# EAGLE design US_balise_1 (EAGLE 5.11)
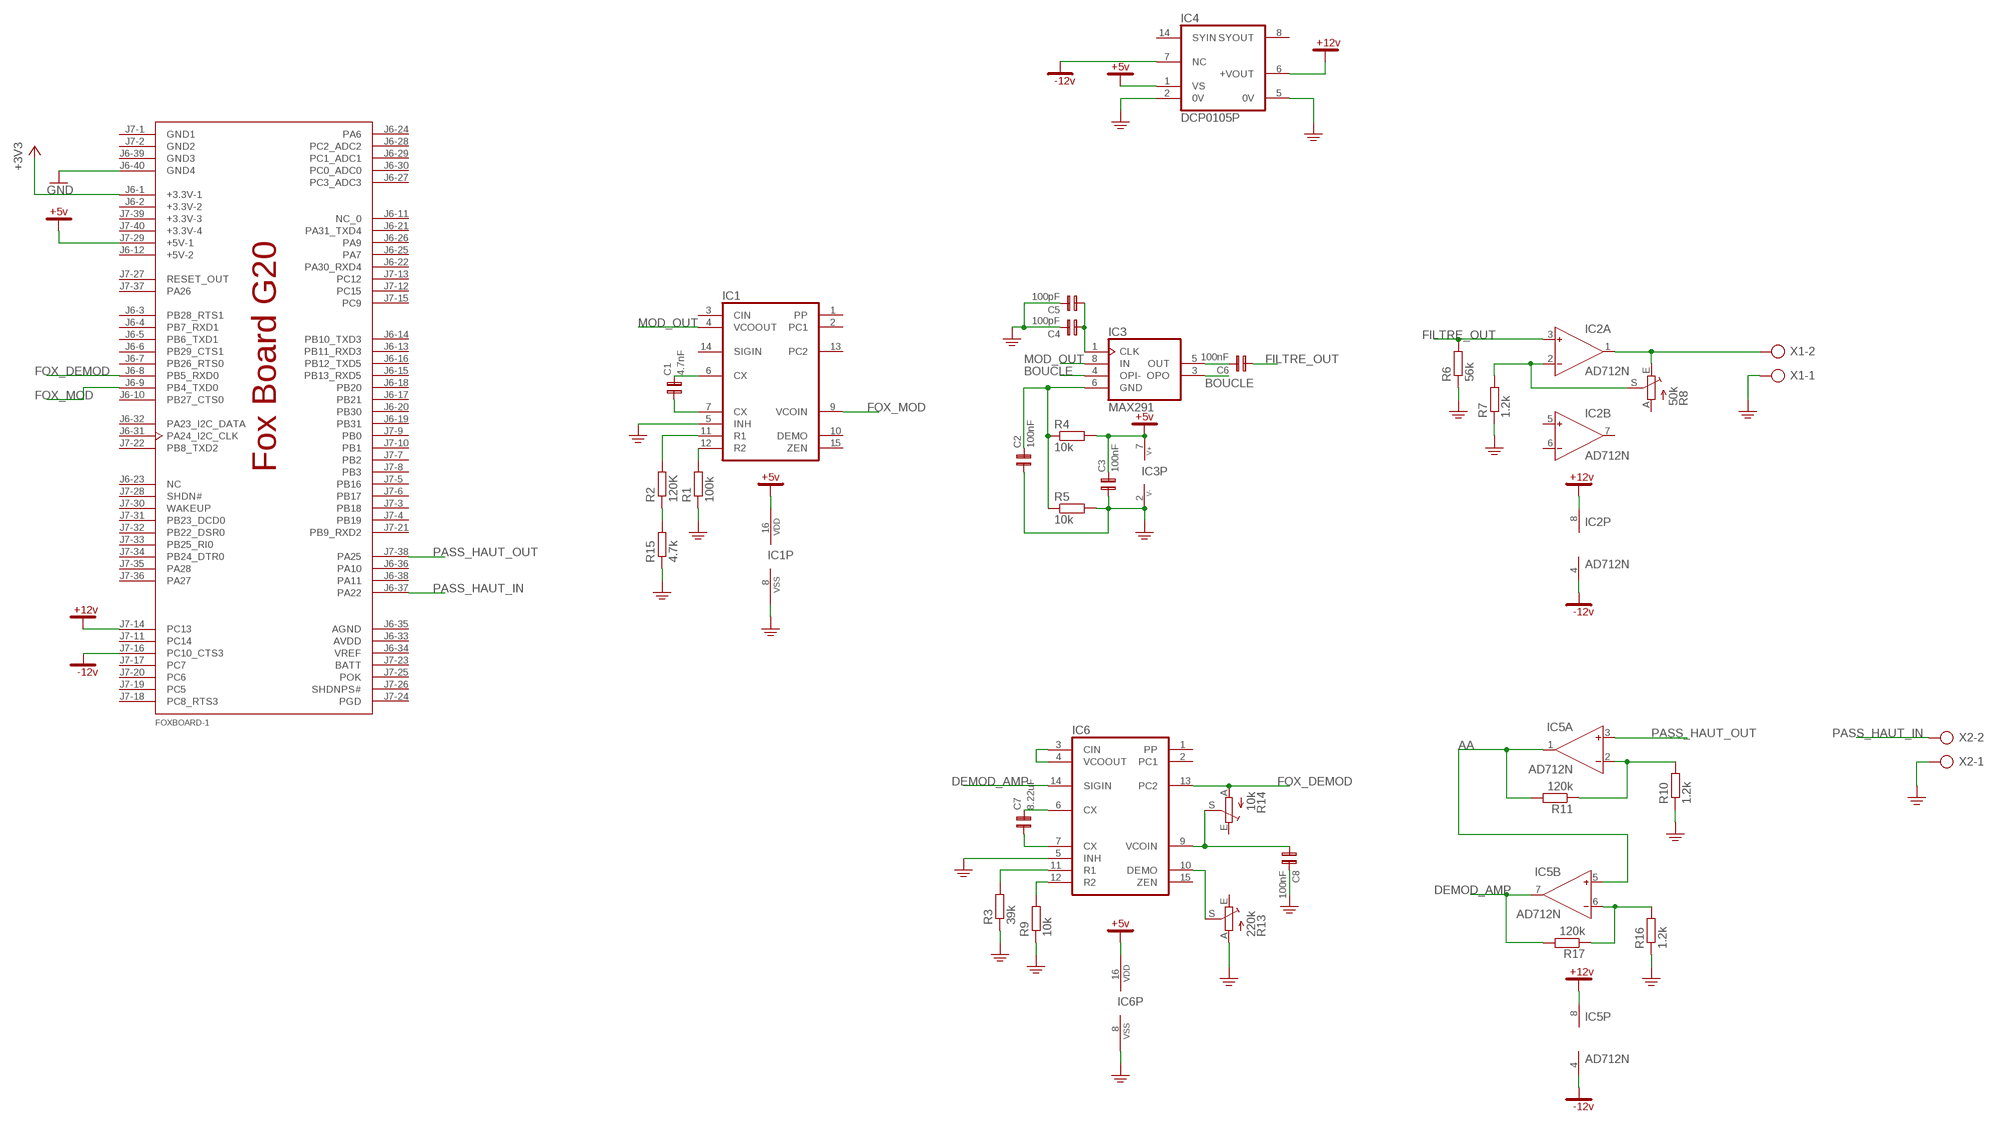
[diagram p0: schematic, sheet 1]

## Parts
C1  4.7nF  C5B2,5  [C5B2,5]
C2  100nF  C5B2,5E  [C5B2,5A]
C3  100nF  C5B2,5E  [C5B2,5A]
C4  100pF  C5B2,5  [C5B2,5]
C5  100pF  C5B2,5  [C5B2,5]
C6  100nF  C5B2,5E  [C5B2,5A]
C7  8.22uF  C5B2,5  [C5B2,5]
C8  100nF  C5B2,5E  [C5B2,5A]
FOXBOARD-1  FOX-BOARD  [FOX-BOARD]
IC1  4046  [DIL16]
IC2  AD712N  [DIL08]
IC3  MAX291  [DIL08]
IC4  DCP0105P  [DIL14/7]
IC5  AD712N  [DIL08]
IC6  4046  [DIL16]
R1  100k  R-EU_0309/12  [0309/12]
R2  120K  R-EU_0309/12  [0309/12]
R3  39k  R-EU_0309/12  [0309/12]
R4  10k  R-EU_0309/12  [0309/12]
R5  10k  R-EU_0309/12  [0309/12]
R6  56k  R-EU_0309/12  [0309/12]
R7  1.2k  R-EU_0309/12  [0309/12]
R8  50k  TRIM_EU-B90P  [SP19L]
R9  10k  R-EU_0309/12  [0309/12]
R10  1.2k  R-EU_0309/12  [0309/12]
R11  120k  R-EU_0309/12  [0309/12]
R13  220k  TRIM_EU-B90P  [SP19L]
R14  10k  TRIM_EU-S63P  [S63P]
R15  4.7k  R-EU_0309/12  [0309/12]
R16  1.2k  R-EU_0309/12  [0309/12]
R17  120k  R-EU_0309/12  [0309/12]
X1  AK300/2  [AK300/2]
X2  AK300/2  [AK300/2]

## Nets
+3V3: FOXBOARD-1.J6-1(+3.3V-1)
+5V: C3.2 FOXBOARD-1.J7-29(+5V-1) IC1.16(VDD) IC3.7(V+) IC4.1(VS) IC6.16(VDD) R4.2
+12V: FOXBOARD-1.J7-14(PC13) IC2.8(P:V+) IC4.6(+VOUT) IC5.8(P:V+)
-12V: FOXBOARD-1.J7-16(PC10_CTS3) IC2.4(P:V-) IC4.7(NC) IC5.4(P:V-)
AA: IC5.1(A:OUT) IC5.5(B:IN+) R11.2
BOUCLE: IC3.3(OPO) IC3.4(OPI-)
DEMOD_AMP: IC5.7(B:OUT) IC6.14(SIGIN) R17.2
FILTRE_OUT: C6.1 IC2.3(A:IN+) R6.2
FOX_DEMOD: FOXBOARD-1.J6-8(PB5_RXD0) IC6.13(PC2) R14.A
FOX_MOD: FOXBOARD-1.J6-9(PB4_TXD0) IC1.9(VCOIN)
GND: C2.1 C3.1 C4.2 C5.2 C8.2 FOXBOARD-1.J6-40(GND4) IC1.5(INH) IC1.8(VSS) IC3.2(V-) IC4.2(0V) IC4.5(0V) IC6.5(INH) IC6.8(VSS) R1.1 R3.1 R5.2 R6.1 R7.1 R9.1 R10.1 R13.A R15.1 R16.1 X1.1 X2.1
MOD_OUT: IC1.4(VCOOUT) IC3.8(IN)
N$1: C1.2 IC1.6(CX)
N$2: C1.1 IC1.7(CX)
N$3: IC1.12(R2) R1.2
N$4: IC1.11(R1) R2.2
N$5: IC6.12(R2) R9.2
N$6: C6.2 IC3.5(OUT)
N$7: C2.2 IC3.6(GND) R4.1 R5.1
N$8: R2.1 R15.2
N$9: C4.1 C5.1 IC3.1(CLK)
N$10: IC2.2(A:IN-) R7.2 R8.S
N$11: IC2.1(A:OUT) R8.E X1.2
N$12: IC5.6(B:IN-) R16.2 R17.1
N$13: IC6.3(CIN) IC6.4(VCOOUT)
N$14: IC5.2(A:IN-) R10.2 R11.1
N$15: C7.2 IC6.6(CX)
N$16: C7.1 IC6.7(CX)
N$17: IC6.11(R1) R3.2
N$21: C8.1 IC6.9(VCOIN) R14.S
N$49: IC6.10(DEMO) R13.S
PASS_HAUT_IN: FOXBOARD-1.J6-37(PA22) X2.2
PASS_HAUT_OUT: FOXBOARD-1.J7-38(PA25) IC5.3(A:IN+)
Unconnected: FOXBOARD-1.J6-3(PB28_RTS1) FOXBOARD-1.J6-4(PB7_RXD1) FOXBOARD-1.J6-5(PB6_TXD1) FOXBOARD-1.J6-6(PB29_CTS1) FOXBOARD-1.J6-7(PB26_RTS0) FOXBOARD-1.J6-10(PB27_CTS0) FOXBOARD-1.J6-11(NC_0) FOXBOARD-1.J6-13(PB11_RXD3) FOXBOARD-1.J6-14(PB10_TXD3) FOXBOARD-1.J6-15(PB13_RXD5) FOXBOARD-1.J6-16(PB12_TXD5) FOXBOARD-1.J6-17(PB21) FOXBOARD-1.J6-18(PB20) FOXBOARD-1.J6-19(PB31) FOXBOARD-1.J6-20(PB30) FOXBOARD-1.J6-21(PA31_TXD4) FOXBOARD-1.J6-22(PA30_RXD4) FOXBOARD-1.J6-23(NC) FOXBOARD-1.J6-24(PA6) FOXBOARD-1.J6-25(PA7) FOXBOARD-1.J6-26(PA9) FOXBOARD-1.J6-27(PC3_ADC3) FOXBOARD-1.J6-28(PC2_ADC2) FOXBOARD-1.J6-29(PC1_ADC1) FOXBOARD-1.J6-30(PC0_ADC0) FOXBOARD-1.J6-31(PA24_I2C_CLK) FOXBOARD-1.J6-32(PA23_I2C_DATA) FOXBOARD-1.J6-33(AVDD) FOXBOARD-1.J6-34(VREF) FOXBOARD-1.J6-35(AGND) FOXBOARD-1.J6-36(PA10) FOXBOARD-1.J6-38(PA11) FOXBOARD-1.J7-3(PB18) FOXBOARD-1.J7-4(PB19) FOXBOARD-1.J7-5(PB16) FOXBOARD-1.J7-6(PB17) FOXBOARD-1.J7-7(PB2) FOXBOARD-1.J7-8(PB3) FOXBOARD-1.J7-9(PB0) FOXBOARD-1.J7-10(PB1) FOXBOARD-1.J7-11(PC14) FOXBOARD-1.J7-12(PC15) FOXBOARD-1.J7-13(PC12) FOXBOARD-1.J7-15(PC9) FOXBOARD-1.J7-17(PC7) FOXBOARD-1.J7-18(PC8_RTS3) FOXBOARD-1.J7-19(PC5) FOXBOARD-1.J7-20(PC6) FOXBOARD-1.J7-21(PB9_RXD2) FOXBOARD-1.J7-22(PB8_TXD2) FOXBOARD-1.J7-23(BATT) FOXBOARD-1.J7-24(PGD) FOXBOARD-1.J7-25(POK) FOXBOARD-1.J7-26(SHDNPS#) FOXBOARD-1.J7-27(RESET_OUT) FOXBOARD-1.J7-28(SHDN#) FOXBOARD-1.J7-30(WAKEUP) FOXBOARD-1.J7-31(PB23_DCD0) FOXBOARD-1.J7-32(PB22_DSR0) FOXBOARD-1.J7-33(PB25_RI0) FOXBOARD-1.J7-34(PB24_DTR0) FOXBOARD-1.J7-35(PA28) FOXBOARD-1.J7-36(PA27) FOXBOARD-1.J7-37(PA26) IC1.1(PP) IC1.2(PC1) IC1.3(CIN) IC1.10(DEMO) IC1.13(PC2) IC1.14(SIGIN) IC1.15(ZEN) IC2.5(B:IN+) IC2.6(B:IN-) IC2.7(B:OUT) IC4.8(SYOUT) IC4.14(SYIN) IC6.1(PP) IC6.2(PC1) IC6.15(ZEN) R8.A R13.E R14.E

## Power pins joined to a net without a drawn wire
+3.3V-2: FOXBOARD-1.J6-2(+3.3V-2)
+3.3V-3: FOXBOARD-1.J7-39(+3.3V-3)
+3.3V-4: FOXBOARD-1.J7-40(+3.3V-4)
+5V-2: FOXBOARD-1.J6-12(+5V-2)
GND1: FOXBOARD-1.J7-1(GND1)
GND2: FOXBOARD-1.J7-2(GND2)
GND3: FOXBOARD-1.J6-39(GND3)

## Library data of the parts
C1 C4 C5 C7 = CAP:C5B2,5
C2 C3 C6 C8 = CAP:C5B2,5E
FOXBOARD-1 = Julien:FOX-BOARD
IC1 IC6 = 40XX:4046
IC2 IC5 = analog-devices:AD712: Dual Precision, Low Cost, High Speed BiFET Op Amp Source: http://www.analog.com/static/imported-files/data_sheets/AD712.pdf; MF: ALTERA CORPORATION; MPN: AD712JNZ; OC_FARNELL: 9604898; OC_NEWARK: 59K4554
IC3 = maxim:MAX291: DIGITAL FILTER; MPN: MAX291CPA+; OC_FARNELL: unknown; OC_NEWARK: 67K4526
IC4 = burr-brown:DCP0105: DC/DC Converters Miniature 5V Input, 1W Isolated Unregulated; MPN: DCP010512BP-U; OC_FARNELL: 1461015; OC_NEWARK: 61M5777
R1-R7 R9-R11 R15-R17 = rcl:R-EU_: RESISTOR, European symbol
R8 R13 R14 = pot:TRIM_EU-: POTENTIOMETER
X1 X2 = con-ptr500:AK300/2: CONNECTOR; OC_FARNELL: unknown; OC_NEWARK: unknown

## Board
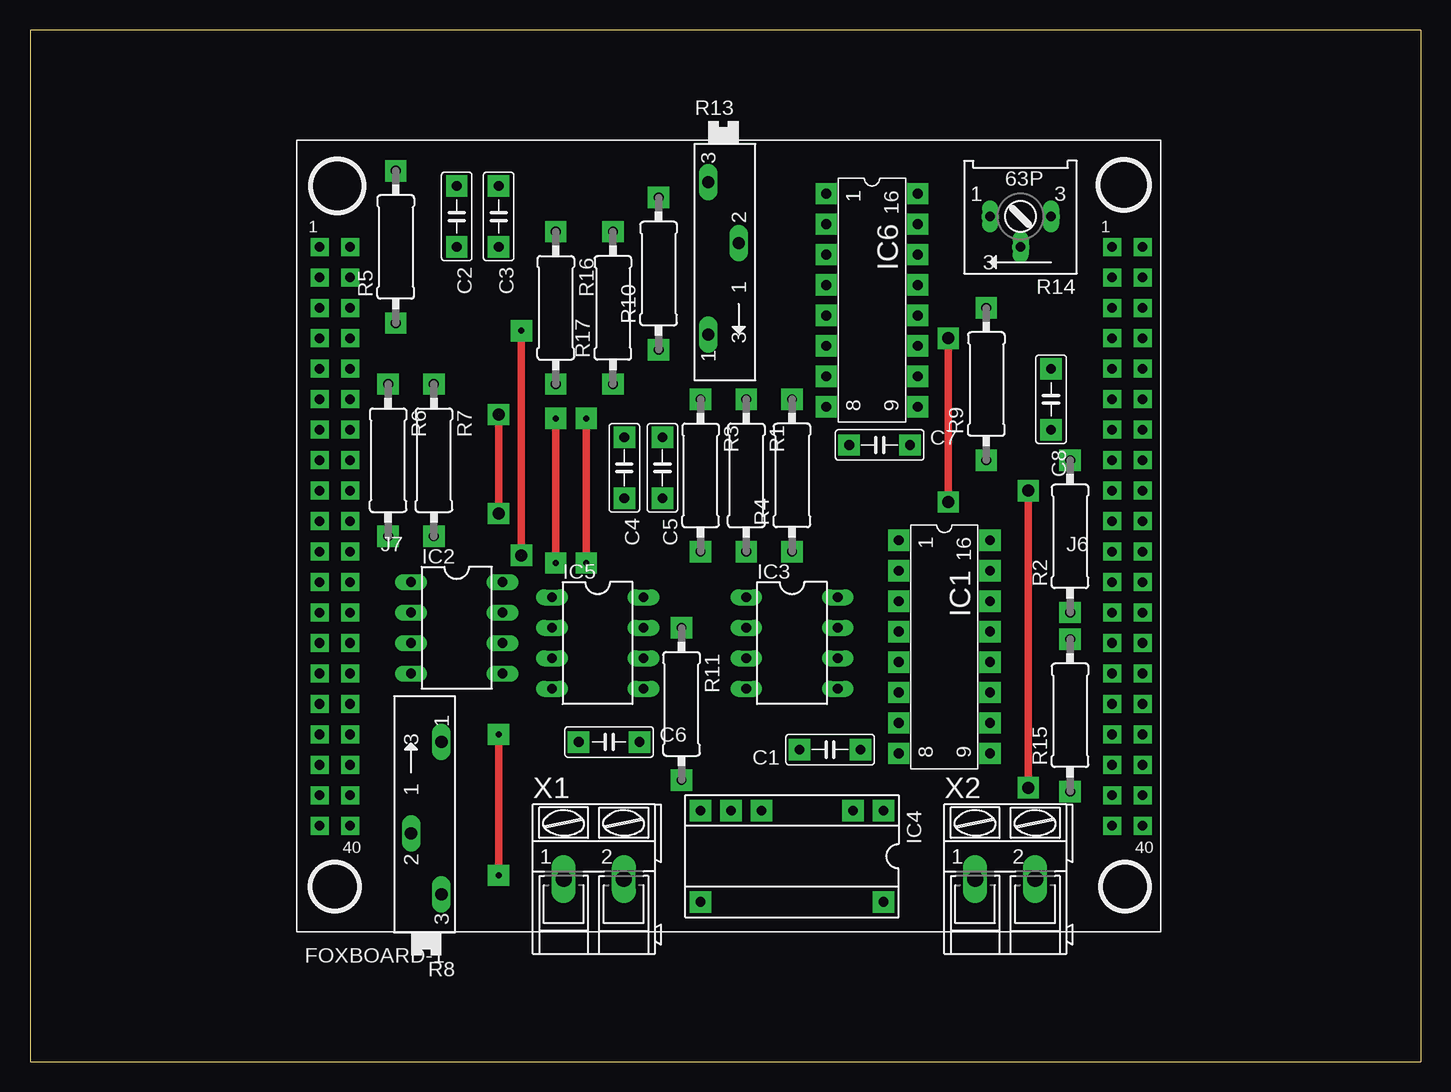
[diagram p1: board, top side]
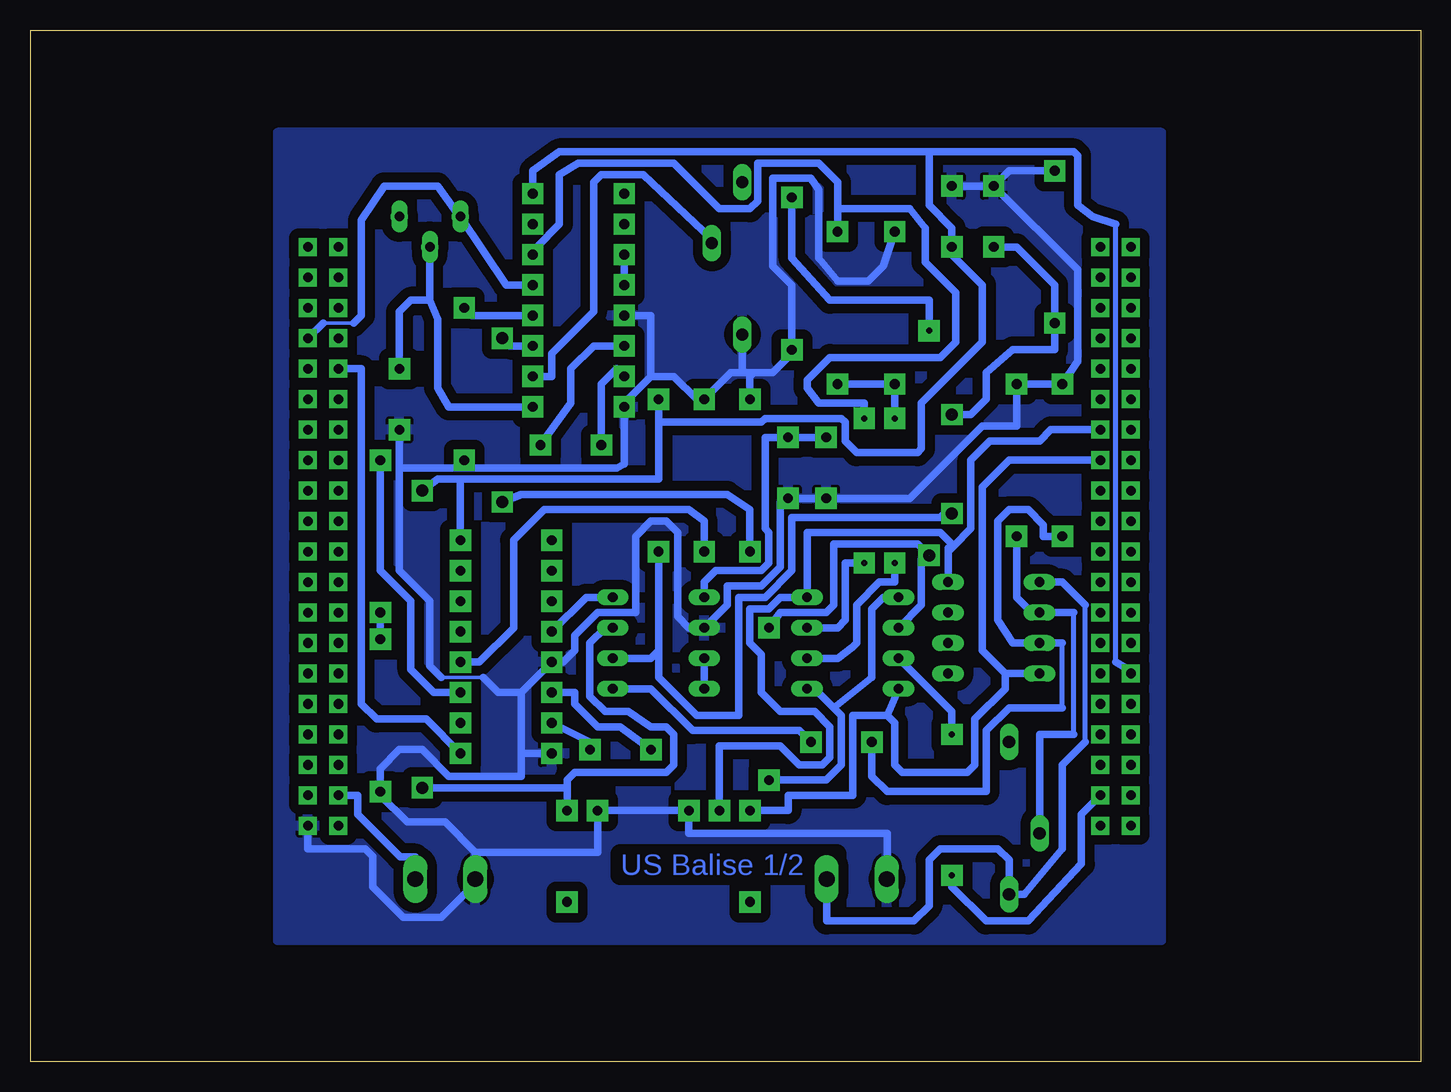
[diagram p2: board, bottom side, seen from below]

Size 115.88 x 86.03 mm. Coordinates in mm from the lower left corner, seen from the top.
Outline: 0,0 115.88,0 115.88,86.03 0,86.03 0,0
Copper layers (1*16): Top 0.035mm / dielectric 1.5mm / Bottom 0.035mm
Design rules "default": minimum track width 10mil, minimum drill 24mil, track to track 8mil, track to pad 8mil, pad to pad 8mil, via to via 8mil, smd to smd 8mil, copper to edge 40mil, drill to drill 8mil, minimum pad ring 10mil, minimum via ring 8mil, stop-mask expansion 4mil, vias tented up to drill 0mil, thermal gap 10mil

### Footprints (pad centres in the part's own frame; a part is rotated, then mirrored left to right if it is on the bottom)
C5B2,5 = drill 0.813 pad 1.778 square: 1 -2.54,0; 2 2.54,0
C5B2,5A = drill 0.813 pad 1.778 square: 1 -2.54,0; 2 2.54,0
FOX-BOARD = drill 0.8 pad 1.5 square: J6-1 31.75,22.86; J6-2 34.29,22.86; J6-3 31.75,20.32; J6-4 34.29,20.32; J6-5 31.75,17.78; J6-6 34.29,17.78; J6-7 31.75,15.24; J6-8 34.29,15.24; J6-9 31.75,12.7; J6-10 34.29,12.7; J6-11 31.75,10.16; J6-12 34.29,10.16; J6-13 31.75,7.62; J6-14 34.29,7.62; J6-15 31.75,5.08; J6-16 34.29,5.08; J6-17 31.75,2.54; J6-18 34.29,2.54; J6-19 31.75,0; J6-20 34.29,0; J6-21 31.75,-2.54; J6-22 34.29,-2.54; J6-23 31.75,-5.08; J6-24 34.29,-5.08; J6-25 31.75,-7.62; J6-26 34.29,-7.62; J6-27 31.75,-10.16; J6-28 34.29,-10.16; J6-29 31.75,-12.7; J6-30 34.29,-12.7; J6-31 31.75,-15.24; J6-32 34.29,-15.24; J6-33 31.75,-17.78; J6-34 34.29,-17.78; J6-35 31.75,-20.32; J6-36 34.29,-20.32; J6-37 31.75,-22.86; J6-38 34.29,-22.86; J6-39 31.75,-25.4; J6-40 34.29,-25.4; J7-1 -34.29,22.86; J7-2 -31.75,22.86; J7-3 -34.29,20.32; J7-4 -31.75,20.32; J7-5 -34.29,17.78; J7-6 -31.75,17.78; J7-7 -34.29,15.24; J7-8 -31.75,15.24; J7-9 -34.29,12.7; J7-10 -31.75,12.7; J7-11 -34.29,10.16; J7-12 -31.75,10.16; J7-13 -34.29,7.62; J7-14 -31.75,7.62; J7-15 -34.29,5.08; J7-16 -31.75,5.08; J7-17 -34.29,2.54; J7-18 -31.75,2.54; J7-19 -34.29,0; J7-20 -31.75,0; J7-21 -34.29,-2.54; J7-22 -31.75,-2.54; J7-23 -34.29,-5.08; J7-24 -31.75,-5.08; J7-25 -34.29,-7.62; J7-26 -31.75,-7.62; J7-27 -34.29,-10.16; J7-28 -31.75,-10.16; J7-29 -34.29,-12.7; J7-30 -31.75,-12.7; J7-31 -34.29,-15.24; J7-32 -31.75,-15.24; J7-33 -34.29,-17.78; J7-34 -31.75,-17.78; J7-35 -34.29,-20.32; J7-36 -31.75,-20.32; J7-37 -34.29,-22.86; J7-38 -31.75,-22.86; J7-39 -34.29,-25.4; J7-40 -31.75,-25.4
DIL16 = drill 0.813 pad 1.778 square: 1 -8.89,-3.81; 2 -6.35,-3.81; 3 -3.81,-3.81; 4 -1.27,-3.81; 5 1.27,-3.81; 6 3.81,-3.81; 7 6.35,-3.81; 8 8.89,-3.81; 9 8.89,3.81; 10 6.35,3.81; 11 3.81,3.81; 12 1.27,3.81; 13 -1.27,3.81; 14 -3.81,3.81; 15 -6.35,3.81; 16 -8.89,3.81
DIL08 = drill 0.813 long: 1 -3.81,-3.81; 2 -1.27,-3.81; 3 1.27,-3.81; 4 3.81,-3.81; 5 3.81,3.81; 6 1.27,3.81; 7 -1.27,3.81; 8 -3.81,3.81
DIL14/7 = drill 0.813 pad 1.6 octagon: 1 -7.62,-3.81; 2 -5.08,-3.81; 5 2.54,-3.81; 6 5.08,-3.81; 7 7.62,-3.81; 8 7.62,3.81; 14 -7.62,3.81
0309/12 = drill 0.813 octagon: 1 -6.35,0; 2 6.35,0
SP19L = drill 1.016 long: A 5.715,-1.27; E -6.985,-1.27; S -1.905,1.27
S63P = drill 0.813 long: A 2.54,0; E -2.54,0; S 0,2.54
AK300/2 = drill 1.321 long: 1 -2.515,0; 2 2.489,0

### Placement (x,y rotation side)
C1  66.67,26.04 180 top
C2  35.56,70.48 270 top
C3  39.05,70.48 270 top
C4  49.53,49.53 270 top
C5  52.7,49.53 270 top
C6  48.26,26.67 0 top
C7  70.8,51.44 0 top
C8  85.09,55.24 270 top
FOXBOARD-1  58.42,45.09 0 top
IC1  76.2,34.61 270 top
IC2  35.56,36.2 270 top
IC3  63.5,34.92 270 top
IC4  63.5,17.14 180 top
IC5  47.31,34.92 270 top
IC6  70.17,63.5 270 top
R1  59.69,48.9 270 top
R2  86.68,43.81 90 top
R3  55.88,48.9 270 top
R4  63.5,48.9 90 top
R5  30.48,67.94 90 top
R6  29.84,50.16 270 top
R7  33.66,50.16 270 top
R8  33.02,20.95 90 top
R9  79.69,56.52 90 top
R10  52.39,65.72 90 top
R11  54.29,29.84 270 top
R13  57.78,66.36 270 top
R14  82.55,70.48 180 top
R15  86.68,28.89 90 top
R16  43.81,62.87 270 top
R17  48.58,62.87 90 top
X1  46.99,15.24 0 top
X2  81.28,15.24 0 top

### Tracks (layer width: path | path; a pad name or v marks a point on that pad's centre or on a via)
+5V  (via drill 1 pad 0.13)
  Top 0.61: v83.19,47.62 v83.19,22.86
  Bottom 0.406: 25.4,33.34 25.4,69.85
  Bottom 0.61: 71.12,22.86 71.12,23.5 70.48,24.13 62.87,24.13 62.23,24.77 62.23,27.3 62.87,27.94 64.14,27.94 66.04,29.21 67.94,29.21 69.22,30.48 69.22,34.92 67.94,36.2 IC3.7 | 71.12,22.86 IC4.1 | 80.01,48.58 IC1.16 | 80.01,48.58 63.5,48.58 R4.2 63.5,53.34 54.93,53.34 54.61,53.66 48.26,53.66 47.94,53.34 47.94,51.75 46.99,50.8 41.91,50.8 41.59,51.12 41.59,54.93 36.51,60.01 36.51,64.77 39.05,67.31 C3.2 39.05,69.53 40.96,71.44 40.96,75.88 | FOXBOARD-1.J7-29 23.81,32.38 25.4,33.34 | 25.4,69.85 27.3,70.48 28.57,71.44 28.57,75.56 28.89,75.88 40.96,75.88 | 80.01,48.58 81.92,48.58 v83.19,47.62 | v83.19,22.86 71.12,22.86 | IC6.16 73.98,74.3 71.75,75.88 40.96,75.88
+12V
  Bottom 0.61: IC4.6 58.42,26.35 53.34,26.35 51.75,24.77 49.85,24.77 49.21,25.4 49.21,27.94 50.48,29.21 53.34,29.21 54.93,30.8 54.93,33.97 55.88,34.92 55.88,37.78 54.29,37.78 53.34,38.73 IC5.8 51.12,44.13 40.01,44.13 38.89,43.02 | 38.89,43.02 37.47,44.45 37.47,50.16 35.88,51.75 31.75,51.75 30.8,52.7 FOXBOARD-1.J7-14 | 38.89,43.02 39.37,42.55 IC2.8 39.37,42.86
-12V
  Bottom 0.61: 34.61,32.38 IC2.4 | 44.45,28.89 IC5.4 | IC4.7 52.7,20.95 52.7,22.23 47.31,22.23 47.31,28.89 44.45,28.89 | 34.61,32.38 34.61,31.11 37.15,28.57 37.15,24.77 37.78,24.13 43.18,24.13 43.81,24.77 43.81,28.26 44.45,28.89 | FOXBOARD-1.J7-16 34.29,50.16 36.51,47.94 36.51,34.29 34.61,32.38
AA
  Bottom 0.61: IC5.5 50.48,31.11 48.9,29.53 | R11.2 49.53,23.5 48.26,24.77 48.26,28.89 48.9,29.53 | IC5.1 44.77,38.73 45.72,37.78 45.72,32.07 48.9,29.53
BOUCLE
  Bottom 0.61: IC3.4 IC3.3
DEMOD_AMP  (via drill 0.5 pad 1.78)  (1 unrouted)
  Top 0.61: 46.35,41.59 v46.35,53.66
  Bottom 0.61: IC6.14 73.66,67.94 71.75,69.85 71.75,73.98 70.17,74.93 62.23,74.93 58.42,71.12 55.88,71.12 55.24,71.75 55.24,74.93 50.16,74.93 48.58,73.34 48.58,71.12 | 48.58,71.12 R17.2 | 48.58,71.12 42.55,71.12 41.27,69.53 41.27,66.67 38.73,64.14 38.73,60.01 40.01,58.74 49.21,58.74 51.12,56.83 51.12,56.2 50.16,54.93 46.35,54.93 v46.35,53.66 | IC5.7 48.58,36.2 47.94,36.83 47.94,41.59 46.35,41.59
FILTRE_OUT
  Bottom 0.406: 29.84,29.53 29.84,34.92
  Bottom 0.61: 29.84,29.53 34.29,29.53 36.2,27.62 36.2,22.54 44.45,22.54 45.72,23.81 C6.1 | 29.84,34.92 IC2.3 33.97,34.92 35.24,36.83 35.24,45.09 34.29,46.04 32.7,46.04 31.43,44.77 31.43,43.81 R6.2
FOX_DEMOD
  Bottom 0.305: 88.9,61.59 91.44,61.59
  Bottom 0.61: 88.9,61.59 88.27,62.23 88.27,70.17 86.36,73.03 81.92,73.03 80.33,70.8 R14.A 76.2,64.77 IC6.13 | 91.44,61.59 FOXBOARD-1.J6-8
FOX_MOD
  Bottom 0.61: FOXBOARD-1.J6-9 88.27,57.78 88.27,29.84 87,28.57 82.87,28.57 IC1.9
GND
  Bottom 0.305: 78.11,32.07 81.6,32.07
  Bottom 0.61: FOXBOARD-1.J6-40 92.71,17.78 87.95,17.78 87.31,17.14 87.31,14.61 84.77,12.06 81.6,12.06 78.77,14.9 X2.1 78.77,17.46 | X1.1 44.45,15.24 44.45,19.05 60.96,19.05 IC4.5 IC4.2 68.58,17.46 78.77,17.46 | 74.93,25.72 IC1.8 | 74.93,25.72 74.93,23.81 80.96,23.81 83.19,26.04 85.09,26.04 86.68,24.45 R15.1 86.68,22.23 84.45,20 81.28,20 78.77,17.49 78.77,17.46 | C2.1 C3.1 | C2.1 28.57,66.04 28.57,58.42 R6.1 R7.1 33.66,53.02 36.51,53.02 42.55,46.99 C4.2 C5.2 53.34,46.67 53.34,41.27 54.93,39.69 57.78,39.69 57.78,38.1 IC3.2 60.96,36.2 61.91,37.15 61.91,44.13 62.87,45.09 64.14,45.09 65.41,43.81 65.41,37.47 68.58,37.47 70.48,35.56 70.48,34.29 71.44,33.34 IC1.5 74.93,30.8 | 85.09,49.53 79.69,49.53 | 79.69,49.53 66.99,49.53 66.36,49.85 IC6.8 66.04,55.24 64.14,57.15 | 85.09,49.53 C8.2 | 79.69,49.53 R9.1 | R5.2 34.29,74.3 C2.1 | 64.14,57.15 64.14,62.23 IC6.5 | 64.14,57.15 62.23,57.15 60.33,55.24 R1.1 57.47,57.47 56.52,57.47 | 56.52,57.47 55.56,57.47 | 55.56,57.47 53.98,57.47 52.39,59.05 R10.1 52.39,64.77 53.98,66.36 53.98,73.66 50.8,73.66 50.16,72.71 50.16,66.99 48.58,65.09 46.04,65.09 44.77,66.36 R16.1 | 74.93,25.72 74.93,30.8 | 74.93,30.8 76.83,30.8 78.11,32.07 | 81.6,32.07 82.55,33.02 82.55,38.42 85.09,40.96 85.09,49.53 | R3.1 55.88,57.15 55.56,57.47 | 56.52,57.47 R13.A
  pour Bottom (isolate 0.813): 21.91,77.47 95.25,77.47 95.25,10.16 21.59,10.16 21.59,77.47
MOD_OUT
  Bottom 0.61: IC3.8 69.53,38.73 IC1.4
N$1
  Bottom 0.61: IC1.6 70.48,30.8 70.48,29.84 68.58,27.94 66.67,27.94 C1.2
N$2
  Bottom 0.61: C1.1 69.22,26.67 IC1.7
N$3
  Bottom 0.61: R1.2 59.69,45.09 60.96,46.04 73.03,46.04 75.56,43.5 75.56,36.2 78.42,33.34 IC1.12
N$4
  Bottom 0.61: IC1.11 82.23,30.8 84.14,32.7 84.14,38.42 86.68,40.96 R2.2
N$5
  Bottom 0.61: IC6.12 79.06,62.23 R9.2
N$6
  Bottom 0.61: IC3.5 64.14,31.11 60.64,27.62 51.75,27.62 C6.2
N$7  (via drill 1 pad 0.13)  (1 unrouted)
  Top 0.61: v39.05,45.72 39.05,53.98
  Bottom 0.61: IC3.6 64.14,33.66 63.5,34.29 R4.1 63.5,32.07 60.33,28.89 56.83,28.89 56.83,38.73 54.61,38.73 52.39,40.96 52.39,45.4 40.01,45.4 39.69,45.72 v39.05,45.72 | C2.2 33.66,67.94 30.48,64.77 R5.1 30.48,59.37 33.97,59.37 36.2,57.47 36.2,55.24 37.47,53.98 39.05,53.98 39.05,53.66
N$8
  Bottom 0.61: R15.2 R2.1
N$9
  Bottom 0.61: C4.1 C5.1 54.61,52.07 54.61,44.45 54.29,44.13 54.29,41.59 54.93,40.96 58.74,40.96 59.69,40.01 IC3.1
N$10
  Bottom 0.406: 28.89,27.3 28.89,37.47
  Bottom 0.61: R8.S 31.75,27.3 28.89,27.3 | 28.89,37.47 IC2.2 32.38,37.47 33.66,38.73 R7.2
N$11
  Bottom 0.406: 27.94,26.67 27.94,38.1
  Bottom 0.61: X1.2 49.48,11.75 42.23,11.75 40.96,13.02 40.96,16.83 40.01,17.78 35.24,17.78 34.29,16.83 R8.E 33.02,13.97 29.84,17.78 29.84,24.77 27.94,26.67 | 27.94,38.1 29.84,40.01 IC2.1
N$12  (via drill 0.5 pad 1.78)  (1 unrouted)
  Top 0.61: 43.81,41.59 v43.81,53.66
  Bottom 0.61: R17.1 R16.2 v43.81,53.66 | IC5.6 48.58,33.66 47.31,34.61 46.99,34.92 46.99,38.1 45.09,40.01 43.81,40.01 43.81,41.59
N$13
  Bottom 0.61: IC6.4 IC6.3
N$14  (via drill 0.5 pad 1.78)  (1 unrouted)
  Top 0.61: 40.96,42.23 v40.96,60.96
  Bottom 0.61: v40.96,60.96 40.96,63.5 49.21,63.5 52.39,66.99 R10.2 | R11.1 53.34,37.47 49.53,37.47 48.9,38.1 48.9,43.18 41.91,43.18 41.12,42.39 | 41.12,42.39 40.96,42.23 | IC5.2 41.59,38.1 41.59,41.91 41.12,42.39
N$15
  Bottom 0.61: IC6.6 68.9,59.69 70.8,57.78 70.8,54.93 C7.2 73.66,51.75
N$16
  Bottom 0.61: IC6.7 66.99,57.78 68.26,56.52 C7.1
N$17  (via drill 1 pad 0.13)
  Top 0.61: v76.52,46.67 v76.52,60.33
  Bottom 0.61: R3.2 55.88,46.04 57.78,47.31 74.93,47.31 v76.52,46.67 | IC6.11 75.88,59.69 v76.52,60.33
N$18  (via drill 0.5 pad 1.78)
  other vias: 54.29,36.2
N$20  (via drill 0.5 pad 1.78)
  other vias: 43.81,41.59
N$21
  Bottom 0.61: IC6.9 80.96,54.61 81.92,56.2 81.92,61.91 82.55,63.5 | 82.55,63.5 R14.S | 82.55,63.5 84.14,63.5 85.09,62.55 C8.1
N$22  (via drill 1 pad 0.13)
  other vias: 83.19,47.62
N$23  (via drill 0.5 pad 1.78)
  other vias: 54.29,23.5
N$24  (via drill 1 pad 0.13)
  other vias: 39.05,53.98
N$25  (via drill 0.5 pad 1.02)
  other vias: 31.75,19.05
N$26  (via drill 1 pad 0.13)
  other vias: 40.96,42.23
N$27  (via drill 0.5 pad 1.42)
  other vias: 83.82,15.24
N$28  (via drill 0.5 pad 1.02)
  other vias: 34.29,26.67
N$29  (via drill 0.5 pad 1.02)
  other vias: 34.29,13.97
N$30  (via drill 0.5 pad 1.42)
  other vias: 82.55,67.94
N$31  (via drill 0.5 pad 1.42)
  other vias: 49.53,15.24
N$32  (via drill 1 pad 0.13)
  other vias: 83.19,22.86
N$33  (via drill 0.5 pad 1.42)
  other vias: 44.45,15.24
N$34  (via drill 0.5 pad 1.42)
  other vias: 78.74,15.24
N$36  (via drill 0.5 pad 1.42)
  other vias: 56.52,73.34
N$38  (via drill 0.5 pad 1.42)
  other vias: 56.52,60.64
N$39  (via drill 0.5 pad 1.42)
  other vias: 59.05,68.26
N$40  (via drill 0.5 pad 1.42)
  other vias: 85.09,70.48
N$41  (via drill 0.5 pad 1.42)
  other vias: 80.01,70.48
N$42  (via drill 0.5 pad 1.78)
  other vias: 43.81,53.66
N$43  (via drill 0.5 pad 1.78)
  other vias: 43.81,69.22
N$44  (via drill 0.5 pad 1.78)
  other vias: 48.58,56.52
N$45  (via drill 0.5 pad 1.78)
  other vias: 43.81,56.52
N$46  (via drill 0.5 pad 1.78)
  other vias: 48.58,69.22
N$47  (via drill 0.5 pad 1.78)
  other vias: 83.19,47.62
N$48  (via drill 0.5 pad 1.78)
  other vias: 86.68,22.54
N$49
  Bottom 0.61: R13.S 59.05,68.58 64.77,73.98 68.26,73.98 68.9,73.34 68.9,62.55 72.39,59.05 72.39,57.15 IC6.10
PASS_HAUT_IN
  Bottom 0.61: X2.2 83.77,17.09 85.04,17.09 88.58,20.64 88.58,22.23 FOXBOARD-1.J6-37
PASS_HAUT_OUT  (via drill 0.5 pad 1.78)
  Top 0.61: v39.05,15.56 v39.05,27.3
  Bottom 0.61: IC5.3 39.05,29.21 v39.05,27.3 | v39.05,15.56 39.05,14.61 36.2,11.75 32.7,11.75 28.26,16.51 28.26,20.64 FOXBOARD-1.J7-38
S$1  (via drill 1 pad 0.13)
  other vias: 76.52,46.67
S$2  (via drill 1 pad 0.13)
  other vias: 39.05,45.72
S$3  (via drill 0.5 pad 1.78)
  other vias: 86.68,37.47
S$5  (via drill 0.5 pad 1.78)
  other vias: 30.48,74.3
S$6  (via drill 0.5 pad 1.78)
  other vias: 63.5,42.55
S$7  (via drill 0.5 pad 1.78)
  other vias: 29.84,56.52
S$8  (via drill 0.5 pad 1.78)
  other vias: 33.66,56.52
S$9  (via drill 0.5 pad 1.78)
  other vias: 33.66,43.81
S$10  (via drill 0.5 pad 1.78)
  other vias: 29.84,43.81
S$11  (via drill 0.5 pad 1.78)
  other vias: 39.05,53.98
S$12  (via drill 0.5 pad 1.78)
  other vias: 39.05,45.72
S$14  (via drill 0.5 pad 1.78)
  other vias: 40.96,42.23
S$15  (via drill 0.5 pad 1.78)
  other vias: 46.35,41.59
S$16  (via drill 0.5 pad 1.78)
  other vias: 55.88,42.55
S$17  (via drill 0.5 pad 1.78)
  other vias: 59.69,42.55
S$19  (via drill 0.5 pad 1.78)
  other vias: 40.96,60.96
S$20  (via drill 0.5 pad 1.78)
  other vias: 52.39,72.07
S$21  (via drill 0.5 pad 1.78)
  other vias: 55.88,55.24
S$22  (via drill 0.5 pad 1.78)
  other vias: 46.35,53.66
S$23  (via drill 0.5 pad 1.78)
  other vias: 59.69,55.24
S$24  (via drill 0.5 pad 1.78)
  other vias: 63.5,55.24
S$25  (via drill 0.5 pad 1.78)
  other vias: 52.39,59.37
S$26  (via drill 0.5 pad 1.78)
  other vias: 79.69,62.87
S$27  (via drill 0.5 pad 1.78)
  other vias: 76.52,60.33
S$28  (via drill 0.5 pad 1.78)
  other vias: 79.69,50.16
S$29  (via drill 0.5 pad 1.78)
  other vias: 76.52,46.67
S$30  (via drill 0.5 pad 1.78)
  other vias: 86.68,35.24
S$31  (via drill 0.5 pad 1.78)
  other vias: 86.68,50.16
S$32  (via drill 0.5 pad 1.78)
  other vias: 83.19,22.86
S$33  (via drill 0.5 pad 1.78)
  other vias: 30.48,61.59
S$34  (via drill 0.5 pad 1.78)
  other vias: 68.58,20.95
S$35  (via drill 0.5 pad 1.78)
  other vias: 55.88,13.34
S$36  (via drill 0.5 pad 1.78)
  other vias: 39.05,27.3
S$37  (via drill 0.5 pad 1.78)
  other vias: 39.05,15.56
S$39  (via drill 0.5 pad 1.78)
  other vias: 71.12,13.34
S$40  (via drill 0.5 pad 1.78)
  other vias: 71.12,20.95
S$41  (via drill 0.5 pad 1.78)
  other vias: 58.42,20.95
S$42  (via drill 0.5 pad 1.78)
  other vias: 55.88,20.95
S$43  (via drill 0.5 pad 1.78)
  other vias: 60.96,20.95

### Text on the board
Bottom: US Balise 1/2